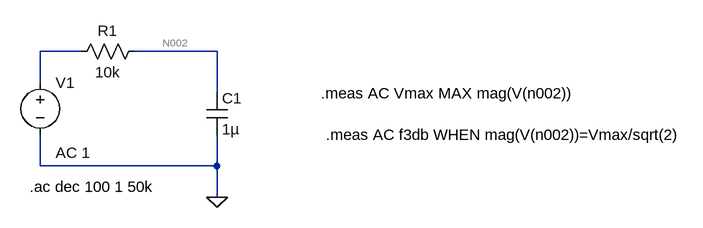
[diagram p0: schematic cut off frequency.asc]
cut off frequency.asc, the LTspice schematic file:
Version 4.1
SHEET 1 1164 680
WIRE 112 112 48 112
WIRE 320 112 192 112
WIRE 48 160 48 112
WIRE 320 176 320 112
WIRE 48 288 48 240
WIRE 320 288 320 240
WIRE 320 288 48 288
WIRE 320 336 320 288
FLAG 320 336 0
SYMBOL voltage 48 144 R0
WINDOW 123 24 124 Left 2
WINDOW 39 0 0 Left 0
SYMATTR InstName V1
SYMATTR Value ""
SYMATTR Value2 AC 1
SYMBOL res 208 96 R90
WINDOW 0 0 56 VBottom 2
WINDOW 3 32 56 VTop 2
SYMATTR InstName R1
SYMATTR Value 10k
SYMBOL cap 304 176 R0
SYMATTR InstName C1
SYMATTR Value 1µ
TEXT 32 320 Left 2 !.ac dec 100 1 50k
TEXT 480 176 Left 2 !.meas AC Vmax MAX mag(V(n002))
TEXT 488 240 Left 2 !.meas AC f3db WHEN mag(V(n002))=Vmax/sqrt(2)

The netlist it stands for:
* cut off frequency.asc
V1 N001 0 AC 1
R1 N002 N001 10k
C1 N002 0 1µ
.ac dec 100 1 50k
.meas AC Vmax MAX mag(V(n002))
.meas AC f3db WHEN mag(V(n002))=Vmax/sqrt(2)
.backanno
.end